# Altium schematic sheet MCU.SchDoc: STM32F405RGT6
size A4; SheetNumber: 1; SheetTotal: 7
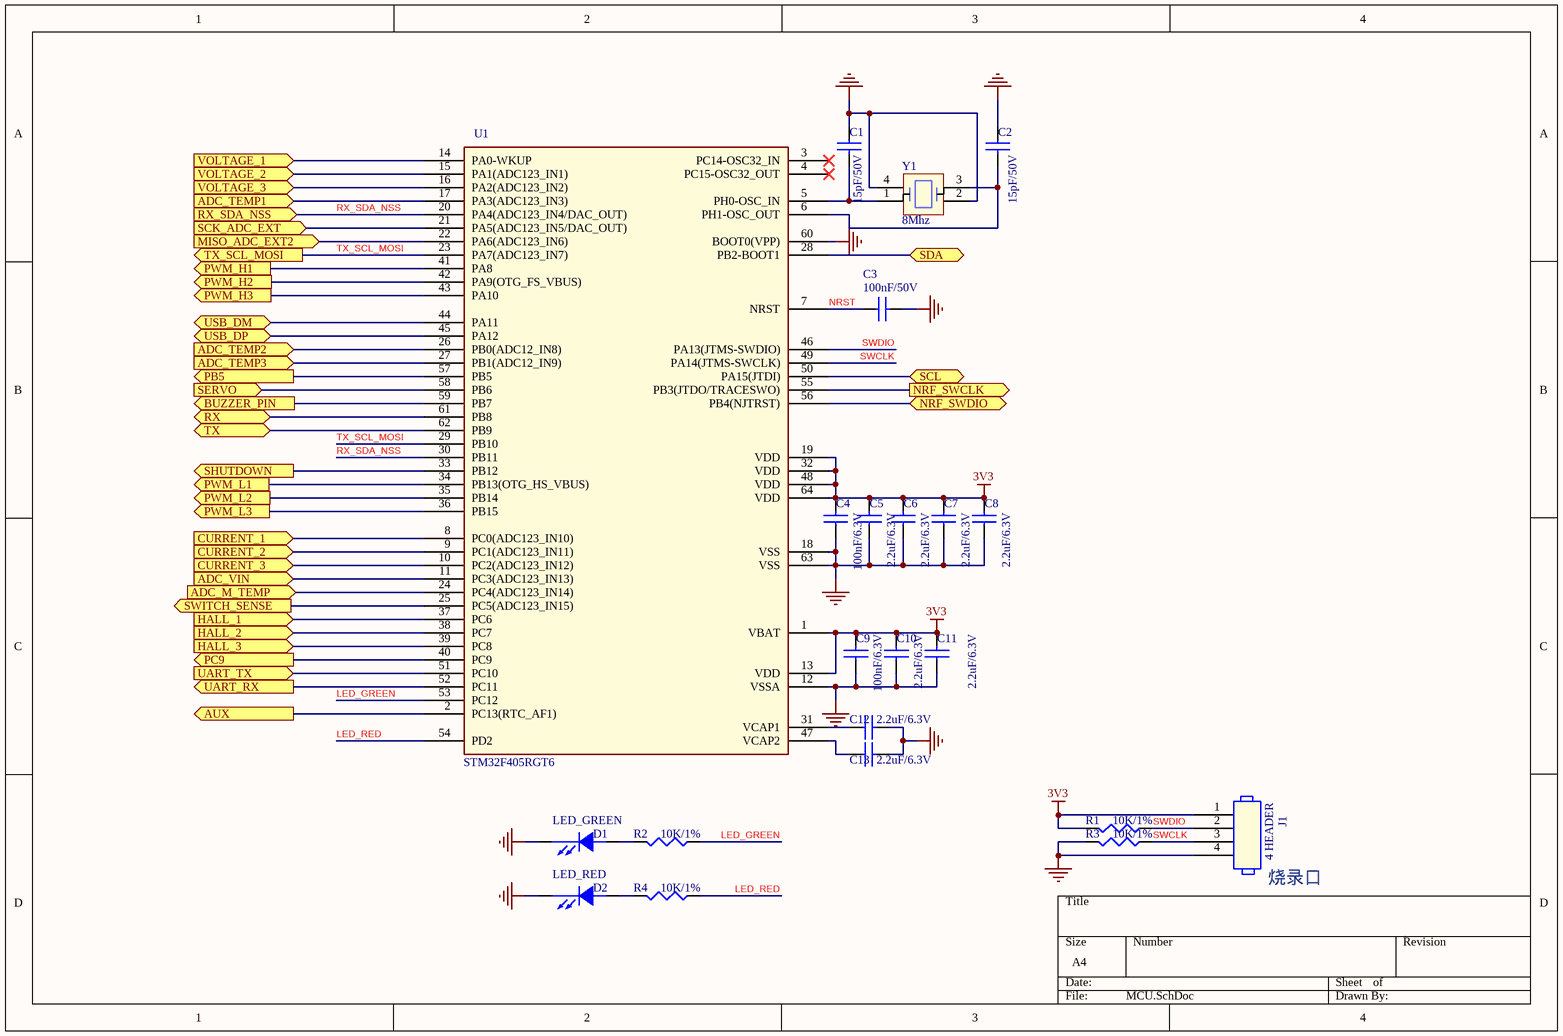
[diagram p0: MCU.SchDoc]

## Parts
C1  15pF/50V  [C0402]
C2  15pF/50V  [C0402]
C3  100nF/50V  [C0402]
C4  100nF/6.3V  [C0402]
C5  2.2uF/6.3V  [C0402]
C6  2.2uF/6.3V  [C0402]
C7  2.2uF/6.3V  [C0402]
C8  2.2uF/6.3V  [C0402]
C9  100nF/6.3V  [C0402]
C10  2.2uF/6.3V  [C0402]
C11  2.2uF/6.3V  [C0402]
C12  2.2uF/6.3V  [C0402]
C13  2.2uF/6.3V  [C0402]
D1  LED_GREEN  [LED0603]
D2  LED_RED  [LED0603]
J1  4 HEADER  [ISP-4P-2_54]
R1  10K/1%  [R0402]
R2  10K/1%  [R0402]
R3  10K/1%  [R0402]
R4  10K/1%  [R0402]
U1  STM32F405RGT6  [LQFP64_10X10_05P]
Y1  8Mhz  [CRYSTAL-SMD_4P-L3.2-W2.5-BL]

## Ports
ADC_M_TEMP (in, see VESC_75100[2A]), ADC_TEMP1 (in, see VESC_75100[3C]), ADC_TEMP2 (in, see VESC_75100[3C]), ADC_TEMP3 (in, see VESC_75100[3C]), ADC_VIN (in, see VESC_75100[3C]), AUX (out, see VESC_75100[2B], Interface[3B]), BUZZER_PIN (out, see VESC_75100[3C]), CURRENT_1 (in, see VESC_75100[3B]), CURRENT_2 (in, see VESC_75100[3B]), CURRENT_3 (in, see VESC_75100[3B]), HALL_1 (in, see VESC_75100[2A]), HALL_2 (in, see VESC_75100[2A]), HALL_3 (in, see VESC_75100[2B]), MISO_ADC_EXT2 (in, see VESC_75100[2B]), NRF_SWCLK (out, see VESC_75100[2C]), NRF_SWDIO (bidir, see VESC_75100[2C]), PB5 (out, see VESC_75100[3B]), PC9 (out, see VESC_75100[3B]), PWM_H1 (out, see VESC_75100[3A]), PWM_H2 (out, see VESC_75100[3B]), PWM_H3 (out, see VESC_75100[3B]), PWM_L1 (out, see VESC_75100[3B]), PWM_L2 (out, see VESC_75100[3B]), PWM_L3 (out, see VESC_75100[3B]), RX (bidir, see VESC_75100[2B]), RX_SDA_NSS (in, see VESC_75100[2B]), SCK_ADC_EXT (in, see VESC_75100[2B]), SCL (bidir, see VESC_75100[2C]), SDA (bidir, see VESC_75100[2C]), SERVO (in, see VESC_75100[2B]), SHUTDOWN (out, see VESC_75100[2C]), SWITCH_SENSE (out, see VESC_75100[2C], Power[1B]), TX (bidir, see VESC_75100[2B]), TX_SCL_MOSI (out, see VESC_75100[2B]), UART_RX (out, see VESC_75100[2C]), UART_TX (in, see VESC_75100[2C]), USB_DM (bidir, see VESC_75100[2B], Interface[2C]), USB_DP (bidir, see VESC_75100[2B], Interface[2C]), VOLTAGE_1 (in, see VESC_75100[3B]), VOLTAGE_2 (in, see VESC_75100[3B]), VOLTAGE_3 (in, see VESC_75100[3B])

## Nets
3V3: C4.2 C5.2 C6.2 C7.2 C8.2 C9.2 C10.2 C11.2 J1.1 R1.2 U1.1(VBAT) U1.13(VDD) U1.19(VDD) U1.32(VDD) U1.48(VDD) U1.64(VDD)
GND: C1.1 C2.1 C3.2 C4.1 C5.1 C6.1 C7.1 C8.1 C9.1 C10.1 C11.1 C12.2 C13.2 D1.1(CATHODE) D2.1(CATHODE) J1.4 R3.2 U1.12(VSSA) U1.18(VSS) U1.60(BOOT0(VPP)) U1.63(VSS) Y1.2(GND_1) Y1.4(GND_2)
ADC_M_TEMP: U1.24(PC4(ADC123_IN14)) ; port ADC_M_TEMP
ADC_TEMP1: U1.17(PA3(ADC123_IN3)) ; port ADC_TEMP1
ADC_TEMP2: U1.26(PB0(ADC12_IN8)) ; port ADC_TEMP2
ADC_TEMP3: U1.27(PB1(ADC12_IN9)) ; port ADC_TEMP3
ADC_VIN: U1.11(PC3(ADC123_IN13)) ; port ADC_VIN
AUX: U1.2(PC13(RTC_AF1)) ; port AUX
BUZZER_PIN: U1.59(PB7) ; port BUZZER_PIN
CURRENT_1: U1.8(PC0(ADC123_IN10)) ; port CURRENT_1
CURRENT_2: U1.9(PC1(ADC123_IN11)) ; port CURRENT_2
CURRENT_3: U1.10(PC2(ADC123_IN12)) ; port CURRENT_3
HALL_1: U1.37(PC6) ; port HALL_1
HALL_2: U1.38(PC7) ; port HALL_2
HALL_3: U1.39(PC8) ; port HALL_3
LED_GREEN: R2.1 U1.53(PC12)
LED_RED: R4.1 U1.54(PD2)
MISO_ADC_EXT2: U1.22(PA6(ADC123_IN6)) ; port MISO_ADC_EXT2
NRF_SWCLK: U1.55(PB3(JTDO/TRACESWO)) ; port NRF_SWCLK
NRF_SWDIO: U1.56(PB4(NJTRST)) ; port NRF_SWDIO
NRST: C3.1 U1.7(NRST)
PB5: U1.57(PB5) ; port PB5
PC9: U1.40(PC9) ; port PC9
PWM_H1: U1.41(PA8) ; port PWM_H1
PWM_H2: U1.42(PA9(OTG_FS_VBUS)) ; port PWM_H2
PWM_H3: U1.43(PA10) ; port PWM_H3
PWM_L1: U1.34(PB13(OTG_HS_VBUS)) ; port PWM_L1
PWM_L2: U1.35(PB14) ; port PWM_L2
PWM_L3: U1.36(PB15) ; port PWM_L3
RX: U1.61(PB8) ; port RX
RX_SDA_NSS: U1.20(PA4(ADC123_IN4/DAC_OUT)) U1.30(PB11) ; port RX_SDA_NSS
SCK_ADC_EXT: U1.21(PA5(ADC123_IN5/DAC_OUT)) ; port SCK_ADC_EXT
SCL: U1.50(PA15(JTDI)) ; port SCL
SDA: U1.28(PB2-BOOT1) ; port SDA
SERVO: U1.58(PB6) ; port SERVO
SHUTDOWN: U1.33(PB12) ; port SHUTDOWN
SWCLK: J1.3 R3.1 U1.49(PA14(JTMS-SWCLK))
SWDIO: J1.2 R1.1 U1.46(PA13(JTMS-SWDIO))
SWITCH_SENSE: U1.25(PC5(ADC123_IN15)) ; port SWITCH_SENSE
TX: U1.62(PB9) ; port TX
TX_SCL_MOSI: U1.23(PA7(ADC123_IN7)) U1.29(PB10) ; port TX_SCL_MOSI
UART_RX: U1.52(PC11) ; port UART_RX
UART_TX: U1.51(PC10) ; port UART_TX
USB_DM: U1.44(PA11) ; port USB_DM
USB_DP: U1.45(PA12) ; port USB_DP
VOLTAGE_1: U1.14(PA0-WKUP) ; port VOLTAGE_1
VOLTAGE_2: U1.15(PA1(ADC123_IN1)) ; port VOLTAGE_2
VOLTAGE_3: U1.16(PA2(ADC123_IN2)) ; port VOLTAGE_3
NetC1_2: C1.2 U1.5(PH0-OSC_IN) Y1.1(CRYSTAL_1)
NetC2_2: C2.2 U1.6(PH1-OSC_OUT) Y1.3(CRYSTAL_2)
NetC12_1: C12.1 U1.31(VCAP1)
NetC13_1: C13.1 U1.47(VCAP2)
NetD1_2: D1.2(ANODE) R2.2
NetD2_2: D2.2(ANODE) R4.2

Not connected (* = marked no-connect by the designer): U1 3(PC14-OSC32_IN)* 4(PC15-OSC32_OUT)*

## Notes on the sheet
- (near J1) 烧录口

## Library data of the parts
C1-C13 = CAP NP: PCB Footprint: C0402
D1 D2 = LED: PCB Footprint: LED0603
R1-R4 = RESISTOR: PCB Footprint: R0402
Y1 = 8Mhz: Crystal or Oscillator; Manufacturer_Name: Seiko Epson Corporation; Manufacturer_Part_Number: Q22FA12800400; Datasheet Link: https://datasheet.lcsc.com/szlcsc/Seiko-Epson-Q22FA12800400_C255875.pdf; Height: 0.5mm
J1 = 4 HEADER: PCB Footprint: ISP-4P-2_54